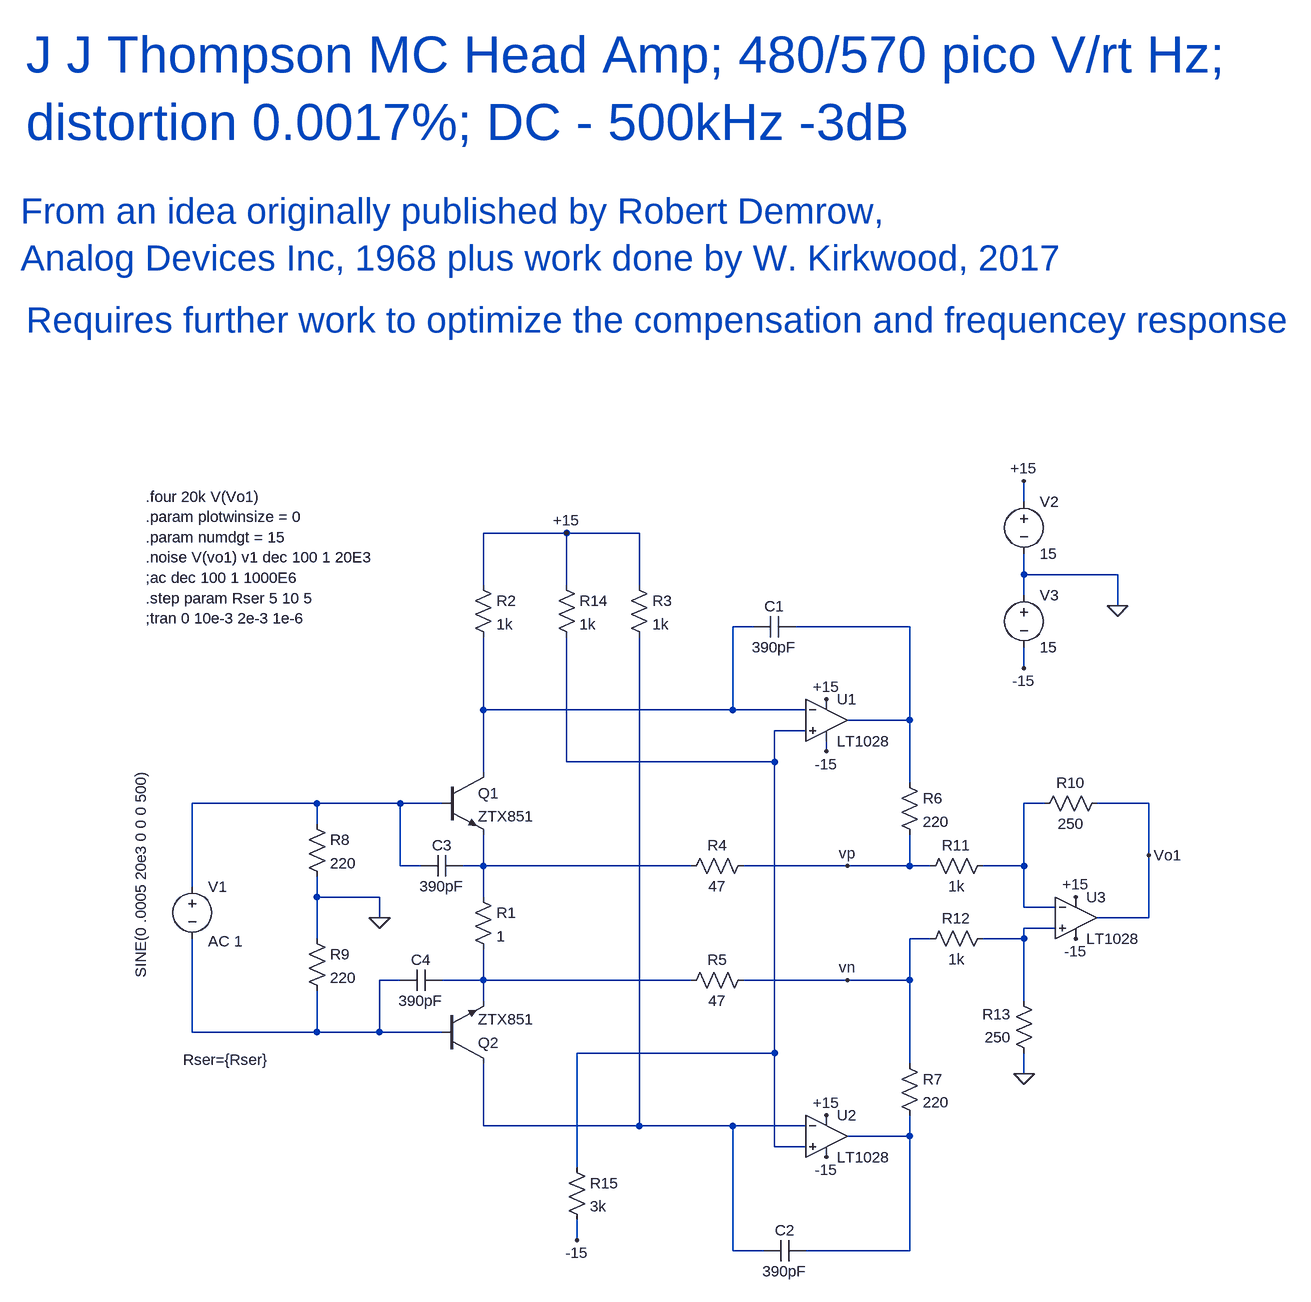
[diagram p0: schematic JJ_Thompson.asc]
JJ_Thompson.asc, the LTspice schematic file:
Version 4
SHEET 1 1832 1552
WIRE 224 320 224 288
WIRE -480 368 -608 368
WIRE -368 368 -480 368
WIRE 224 432 224 400
WIRE 368 432 224 432
WIRE -608 448 -608 368
WIRE -480 448 -480 368
WIRE -368 448 -368 368
WIRE 224 464 224 432
WIRE 368 480 368 432
WIRE -192 512 -224 512
WIRE 48 512 -128 512
WIRE 224 576 224 544
WIRE -608 640 -608 528
WIRE -224 640 -224 512
WIRE -224 640 -608 640
WIRE -112 640 -224 640
WIRE -80 640 -80 624
WIRE 48 656 48 512
WIRE 48 656 -48 656
WIRE -112 672 -160 672
WIRE -80 704 -80 688
WIRE -480 720 -480 528
WIRE -160 720 -160 672
WIRE -160 720 -480 720
WIRE -608 736 -608 640
WIRE 48 752 48 656
WIRE -864 784 -1056 784
WIRE -736 784 -864 784
WIRE -672 784 -736 784
WIRE 256 784 224 784
WIRE 416 784 336 784
WIRE -864 816 -864 784
WIRE 416 864 416 784
WIRE -736 880 -736 784
WIRE -704 880 -736 880
WIRE -608 880 -608 832
WIRE -608 880 -640 880
WIRE -288 880 -608 880
WIRE -48 880 -208 880
WIRE 48 880 48 832
WIRE 48 880 -48 880
WIRE 80 880 48 880
WIRE 224 880 224 784
WIRE 224 880 160 880
WIRE -1056 912 -1056 784
WIRE -864 928 -864 896
WIRE -768 928 -864 928
WIRE -608 928 -608 880
WIRE 224 944 224 880
WIRE 272 944 224 944
WIRE -768 960 -768 928
WIRE 416 960 416 864
WIRE 416 960 336 960
WIRE 272 976 224 976
WIRE -864 992 -864 928
WIRE 80 992 48 992
WIRE 224 992 224 976
WIRE 224 992 160 992
WIRE -736 1056 -768 1056
WIRE -608 1056 -608 1008
WIRE -608 1056 -672 1056
WIRE -288 1056 -608 1056
WIRE -48 1056 -208 1056
WIRE 48 1056 48 992
WIRE 48 1056 -48 1056
WIRE -608 1088 -608 1056
WIRE 224 1088 224 992
WIRE -1056 1136 -1056 992
WIRE -864 1136 -864 1072
WIRE -864 1136 -1056 1136
WIRE -768 1136 -768 1056
WIRE -768 1136 -864 1136
WIRE -672 1136 -768 1136
WIRE -160 1168 -160 720
WIRE -160 1168 -464 1168
WIRE 48 1184 48 1056
WIRE 224 1200 224 1168
WIRE -608 1280 -608 1184
WIRE -368 1280 -368 528
WIRE -368 1280 -608 1280
WIRE -224 1280 -368 1280
WIRE -112 1280 -224 1280
WIRE 48 1296 48 1264
WIRE 48 1296 -48 1296
WIRE -160 1312 -160 1168
WIRE -112 1312 -160 1312
WIRE -464 1344 -464 1168
WIRE -464 1456 -464 1424
WIRE -224 1472 -224 1280
WIRE -176 1472 -224 1472
WIRE 48 1472 48 1296
WIRE 48 1472 -112 1472
FLAG -80 624 +15
FLAG -80 704 -15
FLAG -80 1264 +15
FLAG -80 1328 -15
FLAG -480 368 +15
FLAG -768 960 0
FLAG 304 928 +15
FLAG 304 992 -15
FLAG 224 1200 0
FLAG 416 864 Vo1
FLAG -48 880 vp
FLAG -48 1056 vn
FLAG 368 480 0
FLAG 224 288 +15
FLAG 224 576 -15
FLAG -464 1456 -15
SYMBOL npn -672 736 R0
SYMATTR InstName Q1
SYMATTR Value ZTX851
SYMBOL res -624 912 R0
SYMATTR InstName R1
SYMATTR Value 1
SYMBOL Opamps\\LT1028 -80 592 R0
SYMATTR InstName U1
SYMBOL npn -672 1184 M180
SYMATTR InstName Q2
SYMATTR Value ZTX851
SYMBOL Opamps\\LT1028 -80 1232 R0
SYMATTR InstName U2
SYMBOL res -624 432 R0
SYMATTR InstName R2
SYMATTR Value 1k
SYMBOL res -384 432 R0
SYMATTR InstName R3
SYMATTR Value 1k
SYMBOL res -192 864 R90
WINDOW 0 0 56 VBottom 2
WINDOW 3 32 56 VTop 2
SYMATTR InstName R4
SYMATTR Value 47
SYMBOL res -192 1040 R90
WINDOW 0 0 56 VBottom 2
WINDOW 3 32 56 VTop 2
SYMATTR InstName R5
SYMATTR Value 47
SYMBOL res 32 736 R0
SYMATTR InstName R6
SYMATTR Value 220
SYMBOL res 32 1168 R0
SYMATTR InstName R7
SYMATTR Value 220
SYMBOL res -880 800 R0
SYMATTR InstName R8
SYMATTR Value 220
SYMBOL res -880 976 R0
SYMATTR InstName R9
SYMATTR Value 220
SYMBOL Opamps\\LT1028 304 896 R0
SYMATTR InstName U3
SYMBOL res 352 768 R90
WINDOW 0 0 56 VBottom 2
WINDOW 3 32 56 VTop 2
SYMATTR InstName R10
SYMATTR Value 250
SYMBOL res 176 864 R90
WINDOW 0 0 56 VBottom 2
WINDOW 3 32 56 VTop 2
SYMATTR InstName R11
SYMATTR Value 1k
SYMBOL res 176 976 R90
WINDOW 0 0 56 VBottom 2
WINDOW 3 32 56 VTop 2
SYMATTR InstName R12
SYMATTR Value 1k
SYMBOL res 240 1184 R180
WINDOW 0 36 76 Left 2
WINDOW 3 36 40 Left 2
SYMATTR InstName R13
SYMATTR Value 250
SYMBOL voltage -1056 896 R0
WINDOW 3 -79 -165 VRight 2
WINDOW 123 24 100 Left 2
WINDOW 39 -14 282 Left 2
SYMATTR InstName V1
SYMATTR Value SINE(0 .0005 20e3 0 0 0 500)
SYMATTR Value2 AC 1
SYMATTR SpiceLine Rser={Rser}
SYMBOL voltage 224 304 R0
WINDOW 123 0 0 Left 2
WINDOW 39 0 0 Left 2
SYMATTR InstName V2
SYMATTR Value 15
SYMBOL voltage 224 448 R0
WINDOW 123 0 0 Left 2
WINDOW 39 0 0 Left 2
SYMATTR InstName V3
SYMATTR Value 15
SYMBOL cap -128 496 R90
WINDOW 0 0 32 VBottom 2
WINDOW 3 32 32 VTop 2
SYMATTR InstName C1
SYMATTR Value 390pF
SYMBOL cap -112 1456 R90
WINDOW 0 0 32 VBottom 2
WINDOW 3 32 32 VTop 2
SYMATTR InstName C2
SYMATTR Value 390pF
SYMBOL cap -640 864 R90
WINDOW 0 0 32 VBottom 2
WINDOW 3 32 32 VTop 2
SYMATTR InstName C3
SYMATTR Value 390pF
SYMBOL cap -672 1040 R90
WINDOW 0 0 32 VBottom 2
WINDOW 3 32 32 VTop 2
SYMATTR InstName C4
SYMATTR Value 390pF
SYMBOL res -496 432 R0
SYMATTR InstName R14
SYMATTR Value 1k
SYMBOL res -480 1328 R0
SYMATTR InstName R15
SYMATTR Value 3k
TEXT -1128 312 Left 2 !.four 20k V(Vo1)\n.param plotwinsize = 0\n.param numdgt = 15\n.noise V(vo1) v1 dec 100 1 20E3\n;ac dec 100 1 1000E6\n.step param Rser 5 10 5\n;tran 0 10e-3 2e-3 1e-6
TEXT -1312 -368 Left 6 ;J J Thompson MC Head Amp; 480/570 pico V/rt Hz; \ndistortion 0.0017%; DC - 500kHz -3dB
TEXT -1320 -128 Left 5 ;From an idea originally published by Robert Demrow, \nAnalog Devices Inc, 1968 plus work done by W. Kirkwood, 2017
TEXT -1312 40 Left 5 ;Requires further work to optimize the compensation and frequencey response

The netlist it stands for:
* JJ_Thompson.asc
Q1 N001 N004 N006 0 ZTX851
R1 N006 N009 1
XU1 N003 N001 +15 -15 N002 LT1028  ; pins In+ In- V+ V- OUT
Q2 N010 N008 N009 0 ZTX851
XU2 N003 N010 +15 -15 N011 LT1028  ; pins In+ In- V+ V- OUT
R2 +15 N001 1k
R3 +15 N010 1k
R4 vp N006 47
R5 vn N009 47
R6 N002 vp 220
R7 vn N011 220
R8 N004 0 220
R9 0 N008 220
XU3 N007 N005 +15 -15 Vo1 LT1028  ; pins In+ In- V+ V- OUT
R10 Vo1 N005 250
R11 N005 vp 1k
R12 N007 vn 1k
R13 0 N007 250
V1 N004 N008 SINE(0 .0005 20e3 0 0 0 500) AC 1 Rser={Rser}
V2 +15 0 15
V3 0 -15 15
C1 N002 N001 390pF
C2 N011 N010 390pF
C3 N006 N004 390pF
C4 N009 N008 390pF
R14 +15 N003 1k
R15 N003 -15 3k
.model NPN NPN
.model PNP PNP
.lib standard.bjt
.four 20k V(Vo1)
.param plotwinsize = 0
.param numdgt = 15
.noise V(vo1) v1 dec 100 1 20E3
;ac dec 100 1 1000E6
.step param Rser 5 10 5
;tran 0 10e-3 2e-3 1e-6
* J J Thompson MC Head Amp; 480/570 pico V/rt Hz;
* distortion 0.0017%; DC - 500kHz -3dB
* From an idea originally published by Robert Demrow,
* Analog Devices Inc, 1968 plus work done by W. Kirkwood, 2017
* Requires further work to optimize the compensation and frequencey response
.lib LTC.lib
.backanno
.end